# EAGLE design preamp_module_mic_rev1 (EAGLE 9.5.2)
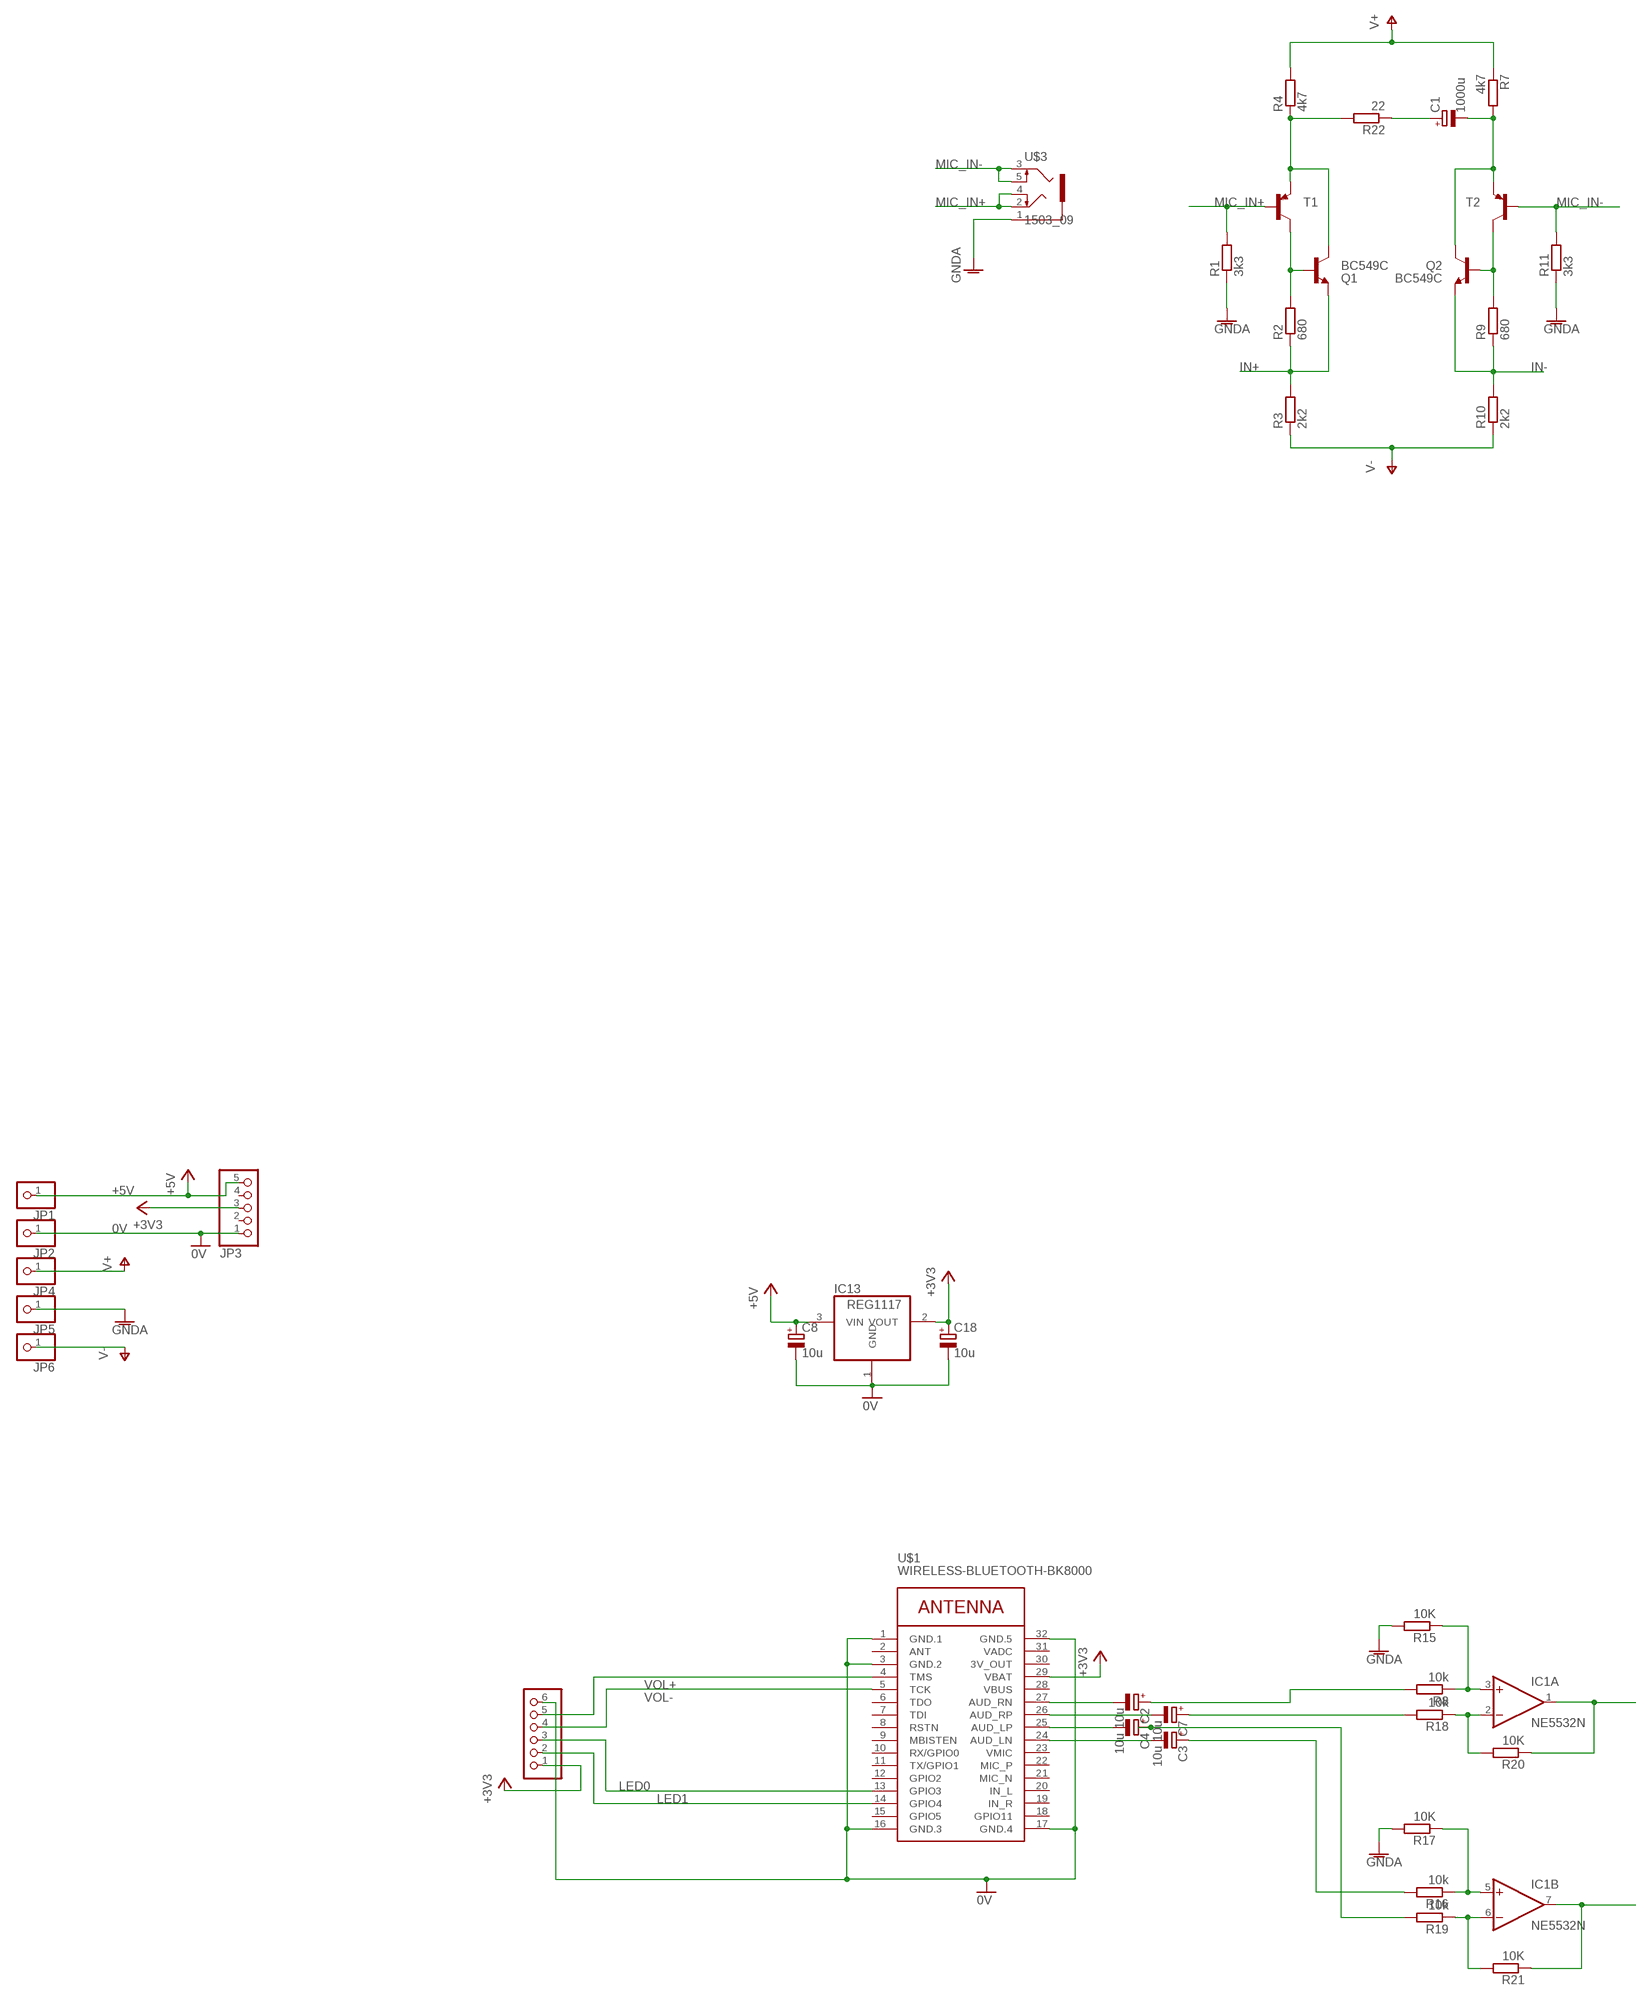
[diagram p0: schematic, sheet 1, part 1 of 2]
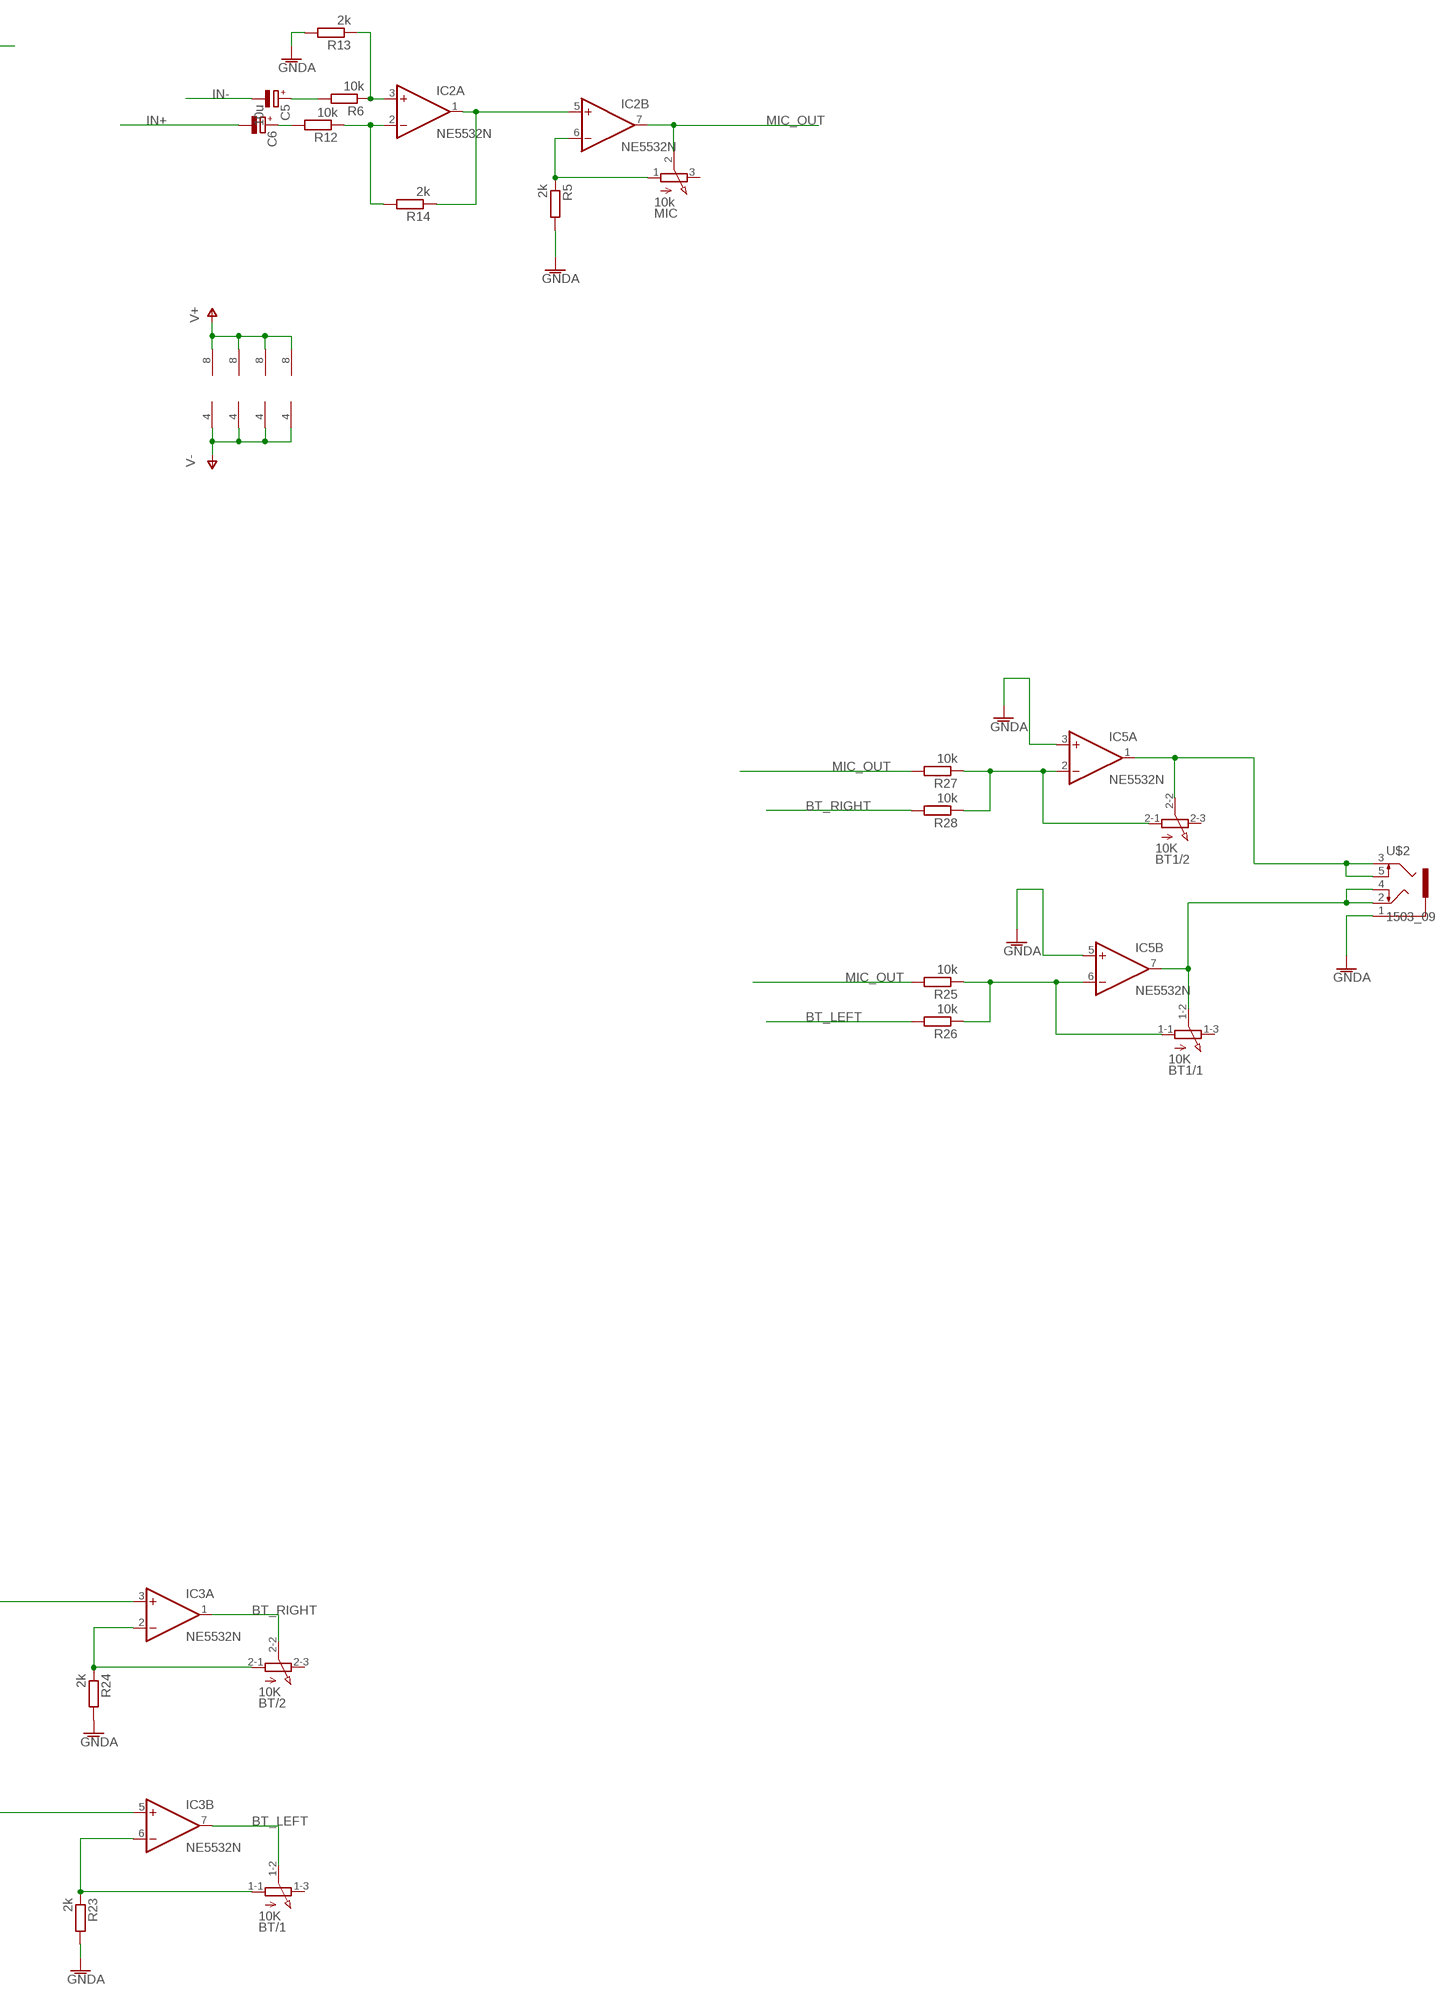
[diagram p1: schematic, sheet 1, part 2 of 2]

## Parts
BT  10K  3RP/1610G  [3RP/1610G]
BT1  10K  3RP/1610G  [3RP/1610G]
C1  1000u  CPOL-EUE5-5  [E5-5]
C2  10u  CPOL-EUE2-5  [E2-5]
C3  10u  CPOL-EUE2-5  [E2-5]
C4  10u  CPOL-EUE2-5  [E2-5]
C5  10u  CPOL-EUE2-5  [E2-5]
C6  10u  CPOL-EUE2-5  [E2-5]
C7  10u  CPOL-EUE2-5  [E2-5]
C8  10u  CPOL-EUE2-5  [E2-5]
C18  10u  CPOL-EUE2-5  [E2-5]
IC1  NE5532N  [DIL08]
IC2  NE5532N  [DIL08]
IC3  NE5532N  [DIL08]
IC5  NE5532N  [DIL08]
IC13  REG1117  [SOT223]
JP1  PINHD-1X1  [1X01]
JP2  PINHD-1X1  [1X01]
JP3  PINHD-1X5  [1X05]
JP4  PINHD-1X1  [1X01]
JP5  PINHD-1X1  [1X01]
JP6  PINHD-1X1  [1X01]
JP7  PINHD-1X6  [1X06]
MIC  10k  3RP/1610N  [3RP/1610N]
Q1  BC549C  [TO92-EBC]
Q2  BC549C  [TO92-EBC]
R1  3k3  R-EU_0207/10  [0207/10]
R2  680  R-EU_0207/10  [0207/10]
R3  2k2  R-EU_0207/10  [0207/10]
R4  4k7  R-EU_0207/10  [0207/10]
R5  2k  R-EU_0207/10  [0207/10]
R6  10k  R-EU_0207/10  [0207/10]
R7  4k7  R-EU_0207/10  [0207/10]
R8  10k  R-EU_0207/10  [0207/10]
R9  680  R-EU_0207/10  [0207/10]
R10  2k2  R-EU_0207/10  [0207/10]
R11  3k3  R-EU_0207/10  [0207/10]
R12  10k  R-EU_0207/10  [0207/10]
R13  2k  R-EU_0207/10  [0207/10]
R14  2k  R-EU_0207/10  [0207/10]
R15  10K  R-EU_0207/10  [0207/10]
R16  10k  R-EU_0207/10  [0207/10]
R17  10K  R-EU_0207/10  [0207/10]
R18  10k  R-EU_0207/10  [0207/10]
R19  10k  R-EU_0207/10  [0207/10]
R20  10K  R-EU_0207/10  [0207/10]
R21  10K  R-EU_0207/10  [0207/10]
R22  22  R-EU_0207/10  [0207/10]
R23  2k  R-EU_0207/10  [0207/10]
R24  2k  R-EU_0207/10  [0207/10]
R25  10k  R-EU_0207/10  [0207/10]
R26  10k  R-EU_0207/10  [0207/10]
R27  10k  R-EU_0207/10  [0207/10]
R28  10k  R-EU_0207/10  [0207/10]
T1  2N4403-PNP-TO92-EBC  [TO92-EBC]
T2  2N4403-PNP-TO92-EBC  [TO92-EBC]
U$1  WIRELESS-BLUETOOTH-BK8000  [WIRELESS-BLUETOOTH-BK8000]
U$2  1503_09  [1503_09]
U$3  1503_09  [1503_09]

## Nets
0V: C8.- C18.- IC13.1(GND) JP2.1 JP3.1 JP7.6 U$1.1(GND.1) U$1.3(GND.2) U$1.16(GND.3) U$1.17(GND.4) U$1.32(GND.5)
+3V3: C18.+ IC13.2(VOUT) JP3.3 JP7.1 U$1.29(VBAT)
+5V: C8.+ IC13.3(VIN) JP1.1 JP3.5
BT_LEFT: BT.1-2(/1:S) IC3.7(B:OUT) R26.2
BT_RIGHT: BT.2-2(/2:S) IC3.1(A:OUT) R28.2
GNDA: IC5.3(A:+IN) IC5.5(B:+IN) JP5.1 R1.1 R5.2 R11.1 R13.2 R15.2 R17.2 R23.2 R24.2 U$2.1 U$3.1
IN+: C6.- Q1.E R2.1 R3.2
IN-: C5.- Q2.E R9.1 R10.2
LED0: JP7.3 U$1.13(GPIO3)
LED1: JP7.2 U$1.14(GPIO4)
MIC_IN+: R1.2 T1.B U$3.2 U$3.4
MIC_IN-: R11.2 T2.B U$3.3 U$3.5
MIC_OUT: IC2.7(B:OUT) MIC.2(S) R25.2 R27.2
N$1: Q1.B R2.2 T1.C
N$2: Q2.B R9.2 T2.C
N$3: IC2.6(B:-IN) MIC.1(A) R5.1
N$4: C1.- Q2.C R7.2 T2.E
N$5: C2.- U$1.27(AUD_RN)
N$6: Q1.C R4.1 R22.2 T1.E
N$7: IC1.3(A:+IN) R8.1 R15.1
N$8: IC1.5(B:+IN) R16.1 R17.1
N$9: C2.+ R8.2
N$10: C1.+ R22.1
N$11: C6.+ R12.2
N$12: IC2.2(A:-IN) R12.1 R14.2
N$13: C5.+ R6.2
N$14: IC2.3(A:+IN) R6.1 R13.1
N$15: IC2.1(A:OUT) IC2.5(B:+IN) R14.1
N$16: C3.- U$1.24(AUD_LN)
N$17: C3.+ R16.2
N$18: IC1.2(A:-IN) R18.1 R20.2
N$19: IC1.6(B:-IN) R19.1 R21.2
N$20: C7.+ R18.2
N$21: IC1.1(A:OUT) IC3.3(A:+IN) R20.1
N$22: IC1.7(B:OUT) IC3.5(B:+IN) R21.1
N$23: BT.2-1(/2:A) IC3.2(A:-IN) R24.1
N$24: BT.1-1(/1:A) IC3.6(B:-IN) R23.1
N$25: BT1.2-1(/2:A) IC5.2(A:-IN) R27.1 R28.1
N$26: BT1.1-1(/1:A) IC5.6(B:-IN) R25.1 R26.1
N$27: BT1.2-2(/2:S) IC5.1(A:OUT) U$2.3 U$2.5
N$28: BT1.1-2(/1:S) IC5.7(B:OUT) U$2.2 U$2.4
N$73: C4.- U$1.25(AUD_LP)
N$74: C7.- U$1.26(AUD_RP)
N$85: C4.+ R19.2
V+: IC1.8(P:V+) IC2.8(P:V+) IC3.8(P:V+) IC5.8(P:V+) JP4.1 R4.2 R7.1
V-: IC1.4(P:V-) IC2.4(P:V-) IC3.4(P:V-) IC5.4(P:V-) JP6.1 R3.1 R10.1
VOL+: JP7.5 U$1.4(TMS)
VOL-: JP7.4 U$1.5(TCK)
Unconnected: BT1.1-3(/1:E) BT1.2-3(/2:E) BT.1-3(/1:E) BT.2-3(/2:E) JP3.2 JP3.4 MIC.3(E) U$1.2(ANT) U$1.6(TDO) U$1.7(TDI) U$1.8(RSTN) U$1.9(MBISTEN) U$1.10(RX/GPIO0) U$1.11(TX/GPIO1) U$1.12(GPIO2) U$1.15(GPIO5) U$1.18(GPIO11) U$1.19(IN_R) U$1.20(IN_L) U$1.21(MIC_N) U$1.22(MIC_P) U$1.23(VMIC) U$1.28(VBUS)

## Power pins joined to a net without a drawn wire
3V_OUT: U$1.30(3V_OUT)
VADC: U$1.31(VADC)

## Library data of the parts
BT BT1 = pot:3RP/1610G: 16mm Potentiometer two level Source: http://www.alphapotentiometers.net/html/16mm_pot_2.html
C1-C8 C18 = rcl:CPOL-EU: POLARIZED CAPACITOR, European symbol; SPICEPREFIX: C
IC1-IC3 IC5 = linear:NE5532: AUDIO AMPLIFIER
IC13 = burr-brown:REG1117: 800mA and 1A Low Dropout (LDO) Positive Regulator 1.8V, 2.5V, 2.85V, 3.3V, 5V, and Adj; MPN: REG1117; OC_FARNELL: 1097566; OC_NEWARK: 14P6981
JP1 JP2 JP4-JP6 = pinhead:PINHD-1X1: PIN HEADER
JP3 = pinhead:PINHD-1X5: PIN HEADER
JP7 = pinhead:PINHD-1X6: PIN HEADER
MIC = pot:3RP/1610N: 16mm Potentiometer one level Source: http://www.alphapotentiometers.net/html/16mm_pot_2.html
Q1 Q2 = transistor-npn:BC549*: NPN Transistor
R1-R28 = rcl:R-EU_: RESISTOR, European symbol; SPICEPREFIX: R
T1 T2 = transistor-neu-to92:*-PNP-: PNP Transistror
U$1 = diy-modules:WIRELESS-BLUETOOTH-BK8000: Bluetooth Audio Module based on BK8000L chip More details available here: http://www.electrodragon.com/w/BK8000L Click here to find device on ebay.com <http://www.ebay.com/sch/bk8000l+module>
U$2 U$3 = con-lumberg:1503_09: Jack connectors according to JISC 6560, 3.5 mm Klinkeneinbaukupplung nach JISC 6560, 3,5 mm, 3-polig/ stereo, abgewinkelte Ausführung, mit 2 Öffnern und Lötaugen, für Leiterplatten Rückseitenmontage Source: http://www.lumberg.com/Produkte/PDFs/1503_09.pdf; OC_FARNELL: 1243244; OC_NEWARK: unknown

## Net classes
0 default: width 0.2 mm, drill 0.7 mm, clearance 0.1 mm

## Board
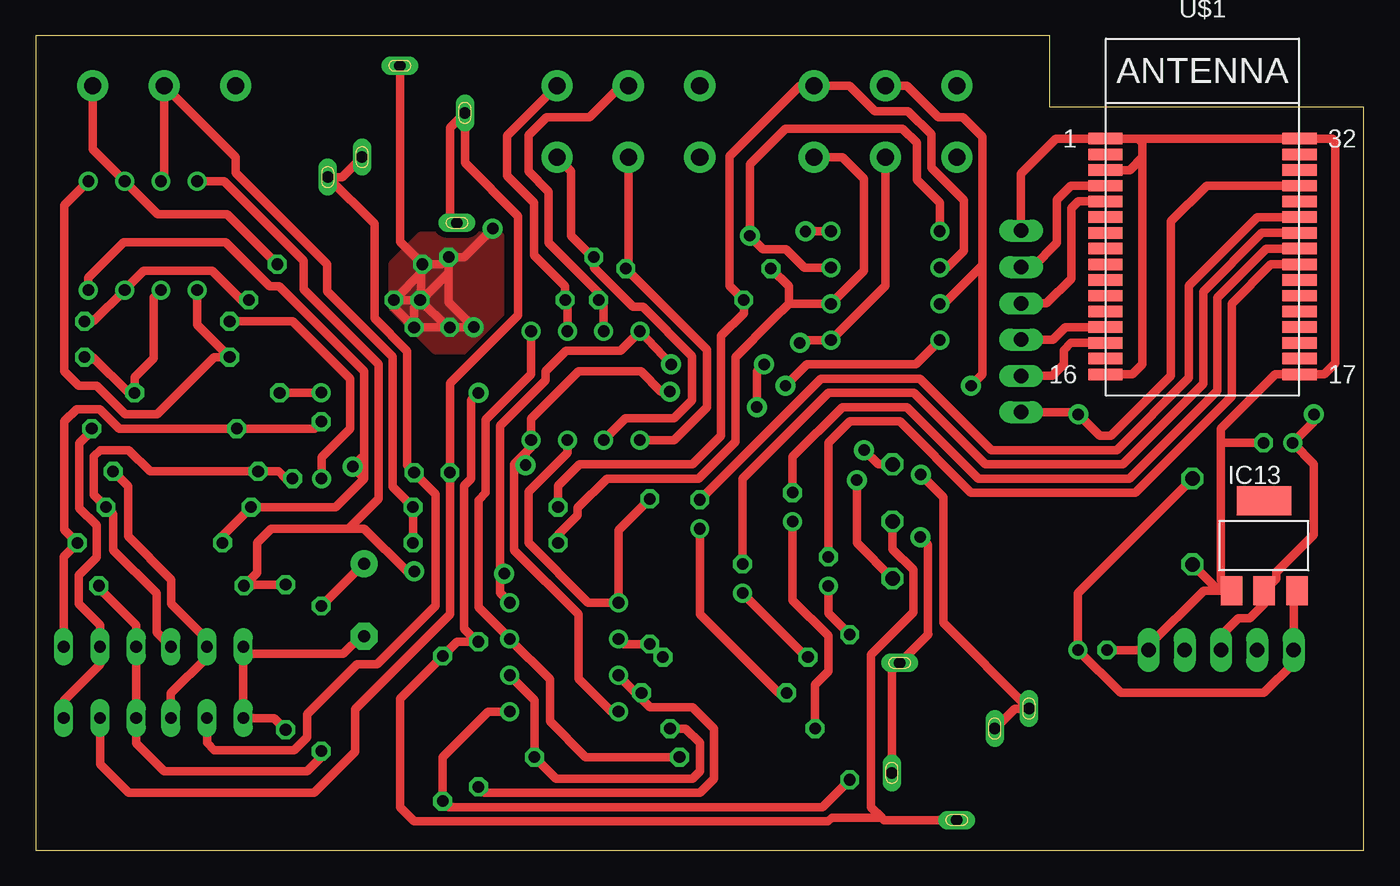
[diagram p2: board, top side]
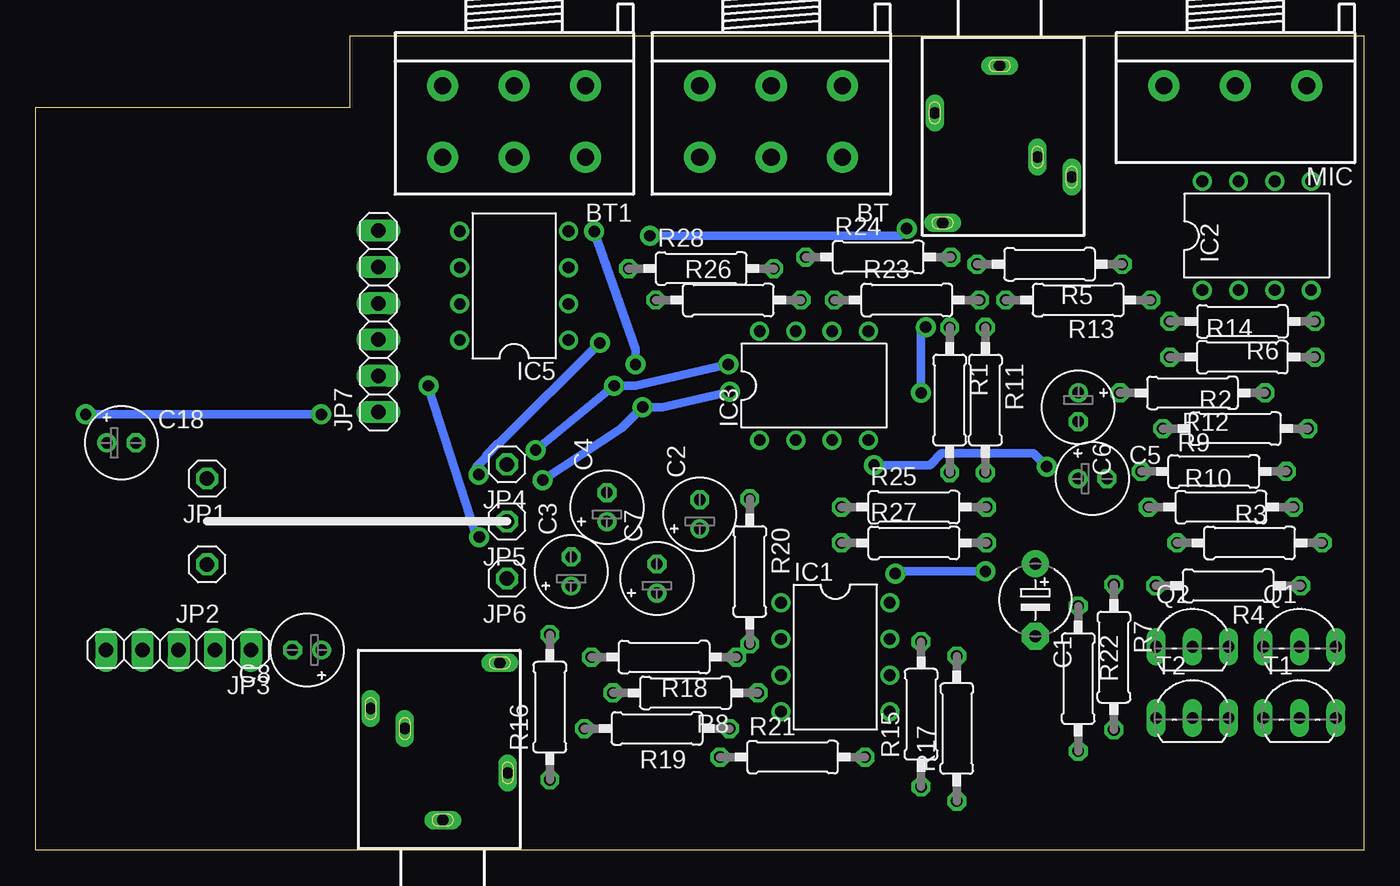
[diagram p3: board, bottom side, seen from below]

Size 93 x 57 mm. Coordinates in mm from the lower left corner, seen from the top.
Outline: 93,0 93,52 71,52 71,57 0,57 0,0 93,0
Copper layers (1*16): Top 0.035mm / dielectric 1.5mm / Bottom 0.035mm
Design rules "default *": minimum track width 0.6mm, minimum drill 0.8mm, track to track 0.4mm, track to pad 0.4mm, pad to pad 0.4mm, via to via 0.4mm, smd to smd 0.4mm, copper to edge 40mil, drill to drill 6mil, minimum pad ring 10mil, minimum via ring 8mil, stop-mask expansion 4mil, vias tented up to drill 0mil, thermal gap 10mil

### Footprints (pad centres in the part's own frame; a part is rotated, then mirrored left to right if it is on the bottom)
3RP/1610G = drill 1.2 pad 2.184: 1-1 -5,0; 1-2 0,0; 1-3 5,0; 2-1 -5,5; 2-2 0,5; 2-3 5,5
E5-5 = drill 0.813 pad 1.905: + -2.54,0 | drill 0.813 pad 1.905 octagon: - 2.54,0
E2-5 = drill 0.813 pad 1.27: + -1.016,0 | drill 0.813 pad 1.27 octagon: - 1.016,0
DIL08 = drill 0.813 pad 1.27: 1 -3.81,-3.81; 2 -1.27,-3.81; 3 1.27,-3.81; 4 3.81,-3.81; 5 3.81,3.81; 6 1.27,3.81; 7 -1.27,3.81; 8 -3.81,3.81
SOT223 = smd 1.499 x 2.007: 1 -2.261,-3.15; 2 0.025,-3.15; 3 2.311,-3.15 | smd 3.81 x 2.007: 4 0,3.15
1X01 = drill 1.016 octagon: 1 0,0
1X05 = drill 1.016 long: 1 -5.08,0; 2 -2.54,0; 3 0,0; 4 2.54,0; 5 5.08,0
1X06 = drill 1.016 long: 1 -6.35,0; 2 -3.81,0; 3 -1.27,0; 4 1.27,0; 5 3.81,0; 6 6.35,0
3RP/1610N = drill 1.2 pad 2.184: 1 -5,0; 2 0,0; 3 5,0
TO92-EBC = drill 0.813 long: B 0,-1.27; C -2.54,-1.27; E 2.54,-1.27
0207/10 = drill 0.813 octagon: 1 -5.08,0; 2 5.08,0
TO92-EBC' = drill 0.813 long: B 0,-1.27; C 2.54,-1.27; E -2.54,-1.27
WIRELESS-BLUETOOTH-BK8000 = smd 2.4 x 0.8: 1 -6.8,5.5; 2 -6.8,4.4; 3 -6.8,3.3; 4 -6.8,2.2; 5 -6.8,1.1; 6 -6.8,0; 7 -6.8,-1.1; 8 -6.8,-2.2; 9 -6.8,-3.3; 10 -6.8,-4.4; 11 -6.8,-5.5; 12 -6.8,-6.6; 13 -6.8,-7.7; 14 -6.8,-8.8; 15 -6.8,-9.9; 16 -6.8,-11; 17 6.8,-11; 18 6.8,-9.9; 19 6.8,-8.8; 20 6.8,-7.7; 21 6.8,-6.6; 22 6.8,-5.5; 23 6.8,-4.4; 24 6.8,-3.3; 25 6.8,-2.2; 26 6.8,-1.1; 27 6.8,0; 28 6.8,1.1; 29 6.8,2.2; 30 6.8,3.3; 31 6.8,4.4; 32 6.8,5.5
1503_09 = drill 0.8 pad 1.2 long: 1 0,-2.1; 2 -4.55,-5.4; 3 5.05,-9.9; 4 -4,-13.1; 5 2.65,-8.5

### Placement (x,y rotation side)
BT  41.5,53.5 180 bottom
BT1  59.5,53.5 180 bottom
C1  23,17.5 270 bottom
C2  46.5,23.5 90 bottom
C3  55.5,19.5 90 bottom
C4  53,24 90 bottom
C5  19,26 0 bottom
C6  20,31 270 bottom
C7  49.5,19 90 bottom
C8  74,14 180 bottom
C18  87,28.5 0 bottom
IC1  37,13.5 270 bottom
IC2  7.5,43 0 bottom
IC3  38.5,32.5 0 bottom
IC5  59.5,39.5 90 bottom
IC13  86,21.3 0 top
JP1  81,26 180 bottom
JP2  81,20 180 bottom
JP3  83,14 180 bottom
JP4  60,27 180 bottom
JP5  60,23 180 bottom
JP6  60,19 180 bottom
JP7  69,37 90 bottom
MIC  9,53.5 180 bottom
Q1  4.5,15.5 0 bottom
Q2  12,15.5 0 bottom
R1  29,31.5 270 bottom
R2  9,29.5 0 bottom
R3  8,21.5 0 bottom
R4  9.5,18.5 180 bottom
R5  22,41 180 bottom
R6  8.5,37 180 bottom
R7  17.5,13.5 270 bottom
R8  47.5,11 180 bottom
R9  10.5,26.5 0 bottom
R10  10,24 0 bottom
R11  26.5,31.5 270 bottom
R12  12,32 180 bottom
R13  20,38.5 180 bottom
R14  8.5,34.5 0 bottom
R15  31,9.5 90 bottom
R16  57,10 90 bottom
R17  28.5,8.5 90 bottom
R18  49,13.5 180 bottom
R19  49.5,8.5 180 bottom
R20  43,19.5 270 bottom
R21  40,6.5 0 bottom
R22  20,12 270 bottom
R23  32,38.5 0 bottom
R24  34,41.5 0 bottom
R25  31.5,24 0 bottom
R26  44.5,38.5 0 bottom
R27  31.5,21.5 0 bottom
R28  46.4,40.7 0 bottom
T1  [TO92-EBC']  4.5,10.5 0 bottom
T2  [TO92-EBC']  12,10.5 0 bottom
U$1  81.7,44.3 0 top
U$2  64.5,0 180 bottom
U$3  25.5,57 0 bottom

### Tracks (layer width: path | path; a pad name or v marks a point on that pad's centre or on a via)
0V
  Top 0.6: IC13.1 82.85,18.15 JP2.1 | IC13.1 81.78,18.15 77.92,14.29 JP3.1 C8.- | IC13.1 83,18.89 83,28.5 | 83,28.5 83,29.5 86.8,33.3 U$1.17 90.24,33.3 91,34.06 91,49.64 90.84,49.8 U$1.32 77.2,49.8 | C18.- 83,28.5 | 77.2,49.8 U$1.1 71.45,49.8 69,47.35 JP7.6 | 77.2,49.8 77.5,49.5 77.5,48.5 | U$1.3 76.6,47.6 77.5,48.5 | 77.5,48.5 77.5,34 76.8,33.3 U$1.16
+3V3  (via drill 0.8 pad 1.4)
  Top 0.6: v89.5,30.5 89.5,29.98 C18.+ 89.5,27.02 89.5,22.08 86.86,19.44 86.86,18.99 IC13.2 86.03,17.25 85,16.22 84.22,16.22 83,15 JP3.3 | U$1.29 82,46.5 79.5,44 79.5,33.21 75.29,29 74.5,29 v73,30.5 72.85,30.65 JP7.1
  Bottom 0.6: v89.5,30.5 v73,30.5
+5V
  Top 0.6: JP1.1 72.98,17.98 C8.+ 75.98,11 86,11 88.08,13.08 JP3.5 88.08,17.92 IC13.3
BT_LEFT
  Top 0.6: IC3.7 39.77,38.15 R26.2 39.42,39 35.91,42.51 35.91,46.09 34.5,47.5 34.5,50.03 35.76,51.29 38.79,51.29 41,53.5 BT.1-2
BT_RIGHT
  Top 0.6: IC3.1 44.69,28.69 47,31 47,35.02 R28.2 41.5,40.88 BT.2-2
GNDA  (via drill 0.8 pad 1.4)
  Top 0.6: R13.2 25.08,38 R11.1 | R1.1 R11.1 | R5.2 27,40.92 27,38.5 | R11.1 26.5,38 27,38.5 | R5.2 25.5,42.58 U$3.1 | v31,32 30.5,31.5 30.5,26 30,25.5 30,15.5 30.92,14.58 R15.2 29.5,14.58 R17.2 25.5,10.58 25.5,3 26.5,2 55.49,2 55.74,2.25 59.25,2.25 | IC5.5 63.31,45.31 61.71,46.91 61.71,49.5 60.71,50.5 52.5,50.5 50,48 v50,43 50.94,42.06 52.54,42.06 53.83,40.77 IC5.3 | U$2.1 59.4,2.1 59.25,2.25 | 59.25,2.25 58.49,3.01 58.49,13.66 61.46,16.63 61.46,19.61 60,21.07 JP5.1 | v32,43.5 30,41.5 R24.2 | R24.2 28.42,41 R5.2 | R1.1 30.66,36.58 v30.68,36.6 28.92,38.36 R24.2 | R24.2 28.92,40.42 27,38.5 | R5.2 27.08,40.5 R13.2 | R13.2 R23.2 28.84,36.58 R1.1
  Bottom 0.6: v30.68,36.6 31,36.28 v31,32 | v50,43 32.5,43 v32,43.5
  pour Top (no thermals): 25,38 28,35 30,35 32.5,37.5 32.5,43 27,43 25,41
IN+
  Top 0.6: Q1.E 1.96,20.54 R3.2 2,22.42 2,30 2.86,30.86 4.48,30.86 5.84,29.5 R2.1 19.52,29.5 C6.-
IN-
  Top 0.6: Q2.E 8.46,15.23 8.46,17.96 5.42,21 5.42,23.5 R10.2 4.06,24.86 4.06,27.56 4.5,28 6.5,28 8,26.5 R9.1 17,26.5 17.5,26 C5.-
LED0
  Top 0.6: U$1.13 72.1,36.6 71.23,35.73 JP7.3
LED1
  Top 0.6: U$1.14 72.5,35.5 72,35 72,34 71.19,33.19 JP7.2
MIC_IN+
  Top 0.6: U$3.4 29,44.4 29,50.55 U$3.2 30.05,48.1 33.78,44.37 33.78,37.44 29,32.66 R1.2 29,16.5 22.36,9.86 22.36,6.86 19.5,4 6.5,4 4.5,6 T1.B
MIC_IN-
  Top 0.6: T2.B 12,7.5 12.5,7 18.1,7 19,7.9 19,9.5 22.5,13 23.9,13 28,17.1 28,24.92 R11.2 26,26.92 26,34.93 23.72,37.21 23.72,43.83 U$3.3 21.45,47.1 U$3.5
MIC_OUT
  Top 0.6: IC2.7 9,47.04 MIC.2 14,48.5 14,47.41 20.41,41.01 20.41,39.11 25,34.51 25,25.42 R25.2 R27.2
N$1
  Top 0.6: T1.C 1.96,10.46 4.5,13 Q1.B 4.5,15.73 3,17.23 3,19.22 4.28,20.5 4.28,22.72 3.06,23.94 3.06,28.47 3.92,29.33 R2.2
N$2
  Top 0.6: T2.C 9.46,10.96 12,13.5 Q2.B 12,14.73 9.5,17.23 9.5,18.92 6.46,21.96 6.46,25.46 R9.2
N$3
  Top 0.6: MIC.1 4,49.04 IC2.6 8.54,44.5 13.42,44.5 R5.1
N$4
  Top 0.6: R7.2 16.69,9.23 T2.E Q2.C 15.04,13.73 21.54,13.73 22.77,14.96 C1.-
N$5
  Top 0.6: C2.- 50.98,29 51,29 55,33 61.91,33 66.91,28 75.71,28 80.75,33.04 80.75,39.49 85.56,44.3 U$1.27
N$6
  Top 0.6: R4.1 4.42,18.35 7.04,15.73 Q1.C T1.E 7.04,7.46 9,5.5 19,5.5 20,6.5 R22.2
N$7
  Top 0.6: R15.1 31.42,4 46.5,4 47.5,5 47.5,8.5 46,10 43,10 42,11 | 42,11 40.81,12.19 IC1.3 | R8.1 42,11
N$8
  Top 0.6: R16.1 55.08,3 28.92,3 R17.1 28.5,6.5 31.69,9.69 IC1.5
N$9
  Top 0.6: R8.2 52,11 46.5,16.5 C2.+
N$10
  Top 0.6: C1.+ 22.96,20.04 R22.1
N$11
  Top 0.6: R12.2 19.98,32 C6.+
N$12
  Top 0.6: IC2.2 8.27,38.69 8.27,34.43 6.92,33.08 R12.1 6.5,32 4,34.5 R14.2
N$13
  Top 0.6: C5.+ 20.02,27.5 22,29.48 22,33 18,37 R6.2
N$14
  Top 0.6: R6.1 4.04,37 IC2.3 6.23,39.23 7.55,40.55 12.37,40.55 14.42,38.5 R13.1
N$15
  Top 0.6: IC2.1 11.31,36.77 R14.1 12.5,34.5 8.5,30.5 6.26,30.5 4.26,32.5 3,32.5 2,33.5 2,45.12 IC2.5
N$16
  Top 0.6: C3.- 55.5,28.5 57,30 60.5,30 65.5,25 77,25 83.75,31.75 83.75,38.25 86.5,41 U$1.24
N$17
  Top 0.6: R16.2 55.5,16.58 C3.+
N$18
  Top 0.6: IC1.2 41.16,14.42 R20.2 R18.1
N$19
  Top 0.6: IC1.6 34.92,10.5 R21.2 36.42,5 46,5 46.5,5.5 46.5,7.5 45.5,8.5 R19.1
N$20
  Top 0.6: R18.2 53.98,13.5 C7.+
N$21
  Top 0.6: IC3.3 37.23,27.82 34.5,25.09 34.5,21.5 38.69,17.31 IC1.1 40.81,22.39 R20.1
N$22
  Top 0.6: IC3.5 34.69,33.31 31.5,30.12 31.5,25 31,24.5 31,17 33.19,14.81 IC1.7 36,11.96 36,9 38.5,6.5 R21.1
N$23
  Top 0.6: IC3.2 41.29,30.21 44.71,30.21 45.97,31.47 45.97,34.57 42.52,38.02 41.82,38.02 39.08,40.76 R24.1 39,41.5 37.5,43 37.5,47.5 BT.2-1
N$24
  Top 0.6: IC3.6 37.23,38.35 R23.1 37.08,39.46 34.91,41.63 34.91,45.3 33,47.21 33,50 BT.1-1
N$25
  Top 0.6: R27.1 36.58,22.08 37.94,23.44 37.94,23.94 40,26 46.41,26 49,28.59 49,34.5 51.64,37.14 52.73,38.23 | 52.73,38.23 IC5.2 58,40.54 58,47 56.5,48.5 BT1.2-1 | 52.73,38.23 52.73,39.45 R28.1
N$26
  Top 0.6: R25.1 36.58,25.5 38.08,27 46,27 48,29 48,36 49.58,37.58 R26.1 48.58,39.5 48.58,48.58 53.5,53.5 BT1.1-1 56.97,53.5 58.76,51.71 61.09,51.71 62.71,50.09 62.71,47.76 65,45.47 65,41.96 63.81,40.77 IC5.6
N$27  (via drill 0.8 pad 1.4)
  Top 0.6: BT1.2-2 59.5,39.5 IC5.1 53.69,35.69 v53.5,35.5 | U$2.5 68.55,9.9 U$2.3 63.55,15.9 63.55,24.71 v61.98,26.28
  Bottom 0.6: v61.98,26.28 62.18,26.48 62.18,26.78 61.46,27.5 61.46,27.61 60.61,28.46 60.54,28.46 v53.5,35.5
N$28  (via drill 0.8 pad 1.4)
  Top 0.6: BT1.1-2 61.01,53.51 63.22,51.29 64.94,51.29 66.29,49.94 66.29,40.93 | 66.29,40.93 63.59,38.23 IC5.7 | U$2.2 59.95,12.55 U$2.4 62.5,15.1 62.46,15.14 62.46,21.39 v61.95,21.9 | 66.29,40.93 66.29,33.29 v65.5,32.5
  Bottom 0.6: v65.5,32.5 65.5,32.31 62.2,22.15 v61.95,21.9
N$73
  Top 0.6: C4.- 53,27.52 56.48,31 61,31 66,26 76.59,26 82.75,32.16 82.75,38.66 86.19,42.1 U$1.25
N$74
  Top 0.6: C7.- 49.5,26 55.5,32 61.5,32 66.5,27 76.12,27 81.75,32.63 81.75,39.08 85.87,43.2 U$1.26
N$85
  Top 0.6: R19.2 54.58,11.58 55.5,12.5 55.5,15 53,17.5 C4.+
V+  (via drill 0.8 pad 1.4)
  Top 0.6: R7.1 14.66,18.58 R4.2 15.5,19.42 15.5,21.5 16.5,22.5 21.91,22.5 | IC2.8 13.19,46.81 18.75,41.25 18.75,39.25 24,34 24,24.59 21.91,22.5 | v26.5,19.5 26,19.5 23,22.5 21.91,22.5 | IC1.8 32.5,18 32.5,18.5 | JP4.1 59,27 v58,28 | v44.5,34 IC3.8 40.95,34.95 37.14,34.95 35.69,33.5 35.69,32.9 32.5,29.71 32.5,20 | v52.5,32.5 54,34 61.62,34 IC5.8 | 32.5,18.5 32.5,19.05 | 32.5,19.05 32.5,20 | 32.5,19.05 32.5,18.5 | 32.5,20 32.5,19.66 v32.8,19.35 32.5,19.05
  Bottom 0.6: v58,28 v52.5,32.5 51,32.5 v44.5,34 | v32.8,19.35 32.66,19.5 v26.5,19.5
V-  (via drill 0.8 pad 1.4)
  Top 0.6: R3.1 13.08,22 R10.1 21,24 23,26 | IC2.4 3.69,40.07 6.17,42.55 13.29,42.55 16.39,39.46 17.06,39.46 23,33.51 23,27.5 | 23,27.5 23,27 | 23,27 23,26 | 34.3,27.8 34.69,28.19 IC3.4 34.69,30.19 38,33.5 42.39,33.5 43.8,32.09 v44.4,32.09 | 34.3,27.8 33.8,27.3 33.5,27 | 33.5,27 33.5,21 38,16.5 38,12 40.31,9.69 IC1.4 | v51,34 50.5,33.5 v50.5,31 | IC5.4 v53.91,43.31 v53.9,43.3 | 34.3,27.8 v34.3,26.95 34.25,27 33.5,27 | v22.2,26.84 22.36,27 23,27 | JP6.1 57.5,21.5 v57.5,25.89 | v22.2,26.84 23,26.04 23,26 | v22.2,26.84 22.86,27.5 23,27.5
  Bottom 0.6: v57.5,25.89 51.96,29.54 v50.5,31 49.11,31 v44.4,32.09 | v53.9,43.3 51,35.05 v51,34 | v34.3,26.95 30.39,26.95 29.56,27.78 23.14,27.78 v22.2,26.84
VOL+
  Top 0.6: U$1.4 72.5,46.5 71.52,45.52 71.52,42.52 69.81,40.81 JP7.5
VOL-
  Top 0.6: U$1.5 73.01,45.4 72.52,44.91 72.52,40 70.79,38.27 JP7.4

### Text on the board
tPlace: //TODO 4 chargere de 5 volti legate in paralel / //celulele legate in serie sa faca 20V si cu gnd virtual la 10V